# Altium schematic sheet Power.SchDoc
size A; DocumentNumber: 3; SheetNumber: 3; SheetTotal: 6
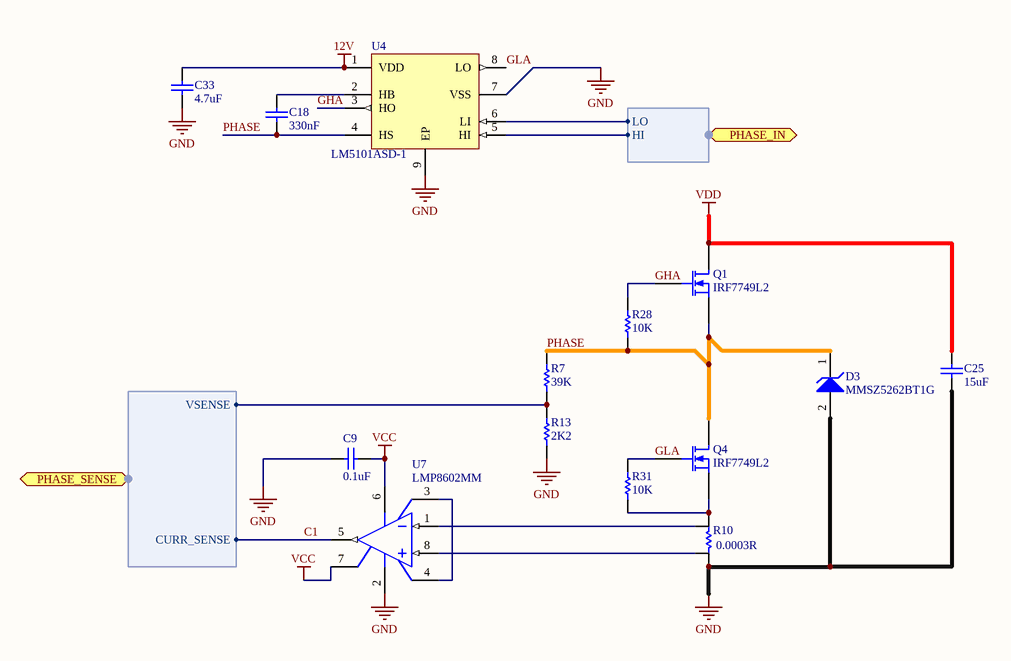
[diagram p0: Power.SchDoc]

## Parts
C9  0.1uF  [CAPC0402(1005)60_M]
C18  330nF  [CAPC0603(1608)100_L]
C25  15uF  [CAPC2220(5750)280_L]
C33  4.7uF  [CAPC0603(1608)100_N]
D3  MMSZ5262BT1G  [ONSC-SOD-123-2-425-04_V]
Q1  IRF7749L2  [DIRECTFET-9]
Q4  IRF7749L2  [DIRECTFET-9]
R7  39K  [RESC0402(1005)_L]
R10  value 0.0003R  [WSL2726]
R13  2K2  [RESC0402(1005)_N]
R28  10K  [RESC0402(1005)_N]
R31  10K  [RESC0402(1005)_N]
U4  LM5101ASD-1  [DFN8]
U7  LMP8602MM  [MUA08A_L]

## Ports
PHASE_IN (harness Phase Input), PHASE_SENSE (harness Phase Sense)

## Harnesses
Phase Sense: VSENSE, CURR_SENSE
Phase Input: LO, HI

## Nets
12V: C33.2 U4.1(VDD)
GND: C9.2 C25.1 C33.1 D3.2(A) R10.1 R13.1 U4.7(VSS) U4.9(EP) U7.2(GND)
VCC: C9.1 U7.6(VS) U7.7(OFS)
VDD: C25.2 Q1.3(D)
C1: U7.5(OUT) ; port PHASE_SENSE.CURR_SENSE
GHA: Q1.1(G) R28.2 U4.3(HO)
GLA: Q4.1(G) R31.2 U4.8(LO)
PHASE: C18.1 D3.1(K) Q1.2(S) Q4.3(D) R7.2 R28.1 U4.4(HS)
NetC18_2: C18.2 U4.2(HB)
NetQ4_2: Q4.2(S) R10.2 R31.1
NetR7_1: R7.1 R13.2 ; port PHASE_SENSE.VSENSE
NetR10_3: R10.3 U7.8(IN+)
NetR10_4: R10.4 U7.1(IN-)
NetU4_5: U4.5(HI) ; port PHASE_IN.HI
NetU4_6: U4.6(LI) ; port PHASE_IN.LO
NetU7_3: U7.3(A1) U7.4(A2)

## Library data of the parts
C9 = CMP-1034-02060-1: CAP 100nF 6.3V ±5% 0402 (1005 Metric) Thickness 0.6mm SMD; Case-EIA: 0402; Tolerance: Â±5%; Case-Metric: 1005; Rated Voltage: 6.3 V; Max Thickness: 0.6 mm; Value: 100nF; Technology: SMT
C18 = CMP-1035-02674-1: CAP 330nF 25V ±10% 0603 (1608 Metric) Thickness 1mm SMD; Tolerance: Â±10%; Case-Metric: 1608; Case-EIA: 0603; Max Thickness: 1 mm; Technology: SMT; Value: 330nF; Rated Voltage: 25 V
C25 = CMP-1042-00760-1: CAP 4.7uF 100V ±10% 2220 (5750 Metric) Thickness 2.8mm SMD; Case-Metric: 5750; Tolerance: Â±10%; Case-EIA: 2220; Technology: SMT; Rated Voltage: 100 V; Value: 15uF; Max Thickness: 2.8 mm
C33 = CMP-1035-02788-1: CAP 4.7uF 16V ±10% 0603 (1608 Metric) Thickness 1mm SMD; Case-Metric: 1608; Tolerance: Â±10%; Case-EIA: 0603; Value: 4.7uF; Technology: SMT; Rated Voltage: 16 V; Max Thickness: 1 mm
D3 = CMP-1060-00504-1: Zener Voltage Regulator, 500 mW, 2-Pin SOD-123, Pb-Free, Tape and Reel; Manufacturer: On Semiconductor; P Max (W): 0.5; VZ Typ (V): 51; PartNumber: MMSZ5262BT1G; PackageVersion: Rev. G, 10/2009; ComponentLink3Description: Package Specification; PackageReference: SOD-123-2-425-04; PackageDescription: 2-Pin SOD, Body 1.6 x 2.69 mm; ComponentLink1Description: Manufacturer URL; ComponentLink2Description: Datasheet; DatasheetVersion: Rev. 12; Mounting Technology: Surface Mount; Packing: Tape and Reel; RoHS: Pb-Free; ComponentLink1URL: http://www.onsemi.com/; ComponentLink3URL: http://www.onsemi.com/pub_link/Collateral/425-04.PDF; ComponentLink2URL: http://www.onsemi.com/pub_link/Collateral/MMSZ5221BT1-D.PDF
Q1 Q4 = IRF7749L2: N-Channel MOSFET; Published: 8-Jun-2000; LatestRevisionDate: 17-Jul-2002; LatestRevisionNote: Re-released for DXP Platform.; PackageVersion: 1995/1996; PackageReference: E3; Publisher: Altium Limited; PackageDescription: TO, Flat Index; 3 In-Line, Axial Leads; Body Dia. 4.6mm; Lead Dia. 0.5 mm (max)
R7 = CMP-1011-00112-1: 39K 0.063W 5% 0402 (1005 Metric)  SMD; Case-Metric: 1005; Value: 39000.00 Ohm; Case-EIA: 0402; Technology: SMT; Tolerance: 5 %; Power: 0.063 W
R10 = WSL27261L000FEB: Resistor; Published: 8-Jun-2000; LatestRevisionDate: 17-Jul-2002; LatestRevisionNote: Re-released for DXP Platform.; PackageReference: AXIAL-0.3; Publisher: Altium Limited; PackageDescription: Axial Device, Thru-Hole; 2 Leads; 0.3 in Pin Spacing
R13 = CMP-1011-00082-1: 2K2 0.063W 5% 0402 (1005 Metric)  SMD; Value: 2200.00 Ohm; Case-EIA: 0402; Case-Metric: 1005; Tolerance: 5 %; Power: 0.063 W; Technology: SMT
R28 R31 = CMP-1011-00098-1: 10K 0.063W 5% 0402 (1005 Metric)  SMD; Case-Metric: 1005; Value: 10000.00 Ohm; Case-EIA: 0402; Technology: SMT; Tolerance: 5 %; Power: 0.063 W
U7 = CMP-0055-01489-1: 60V Common Mode, 50 x Gain, Bidirectional Precision Current Sensing Amplifier, 8-pin Mini SOIC, Pb-Free; Manufacturer: National Semiconductor; CompType: Amplifiers; PowerWise: N; PackageTopMarking: ZXTT*AN3A; PackageVersion: revF, Apr-2008; PackageReference: MUA08A; PackageDescription: MINI SOIC, .118 x .118 x .034in, 8 Lead, .0256in Pitch; Code_JEDEC: MO-187-AA; DatasheetVersion: Mar-2010; RoHS: Y; PinCount: 8